# Altium project ISL6236.PrjPcb
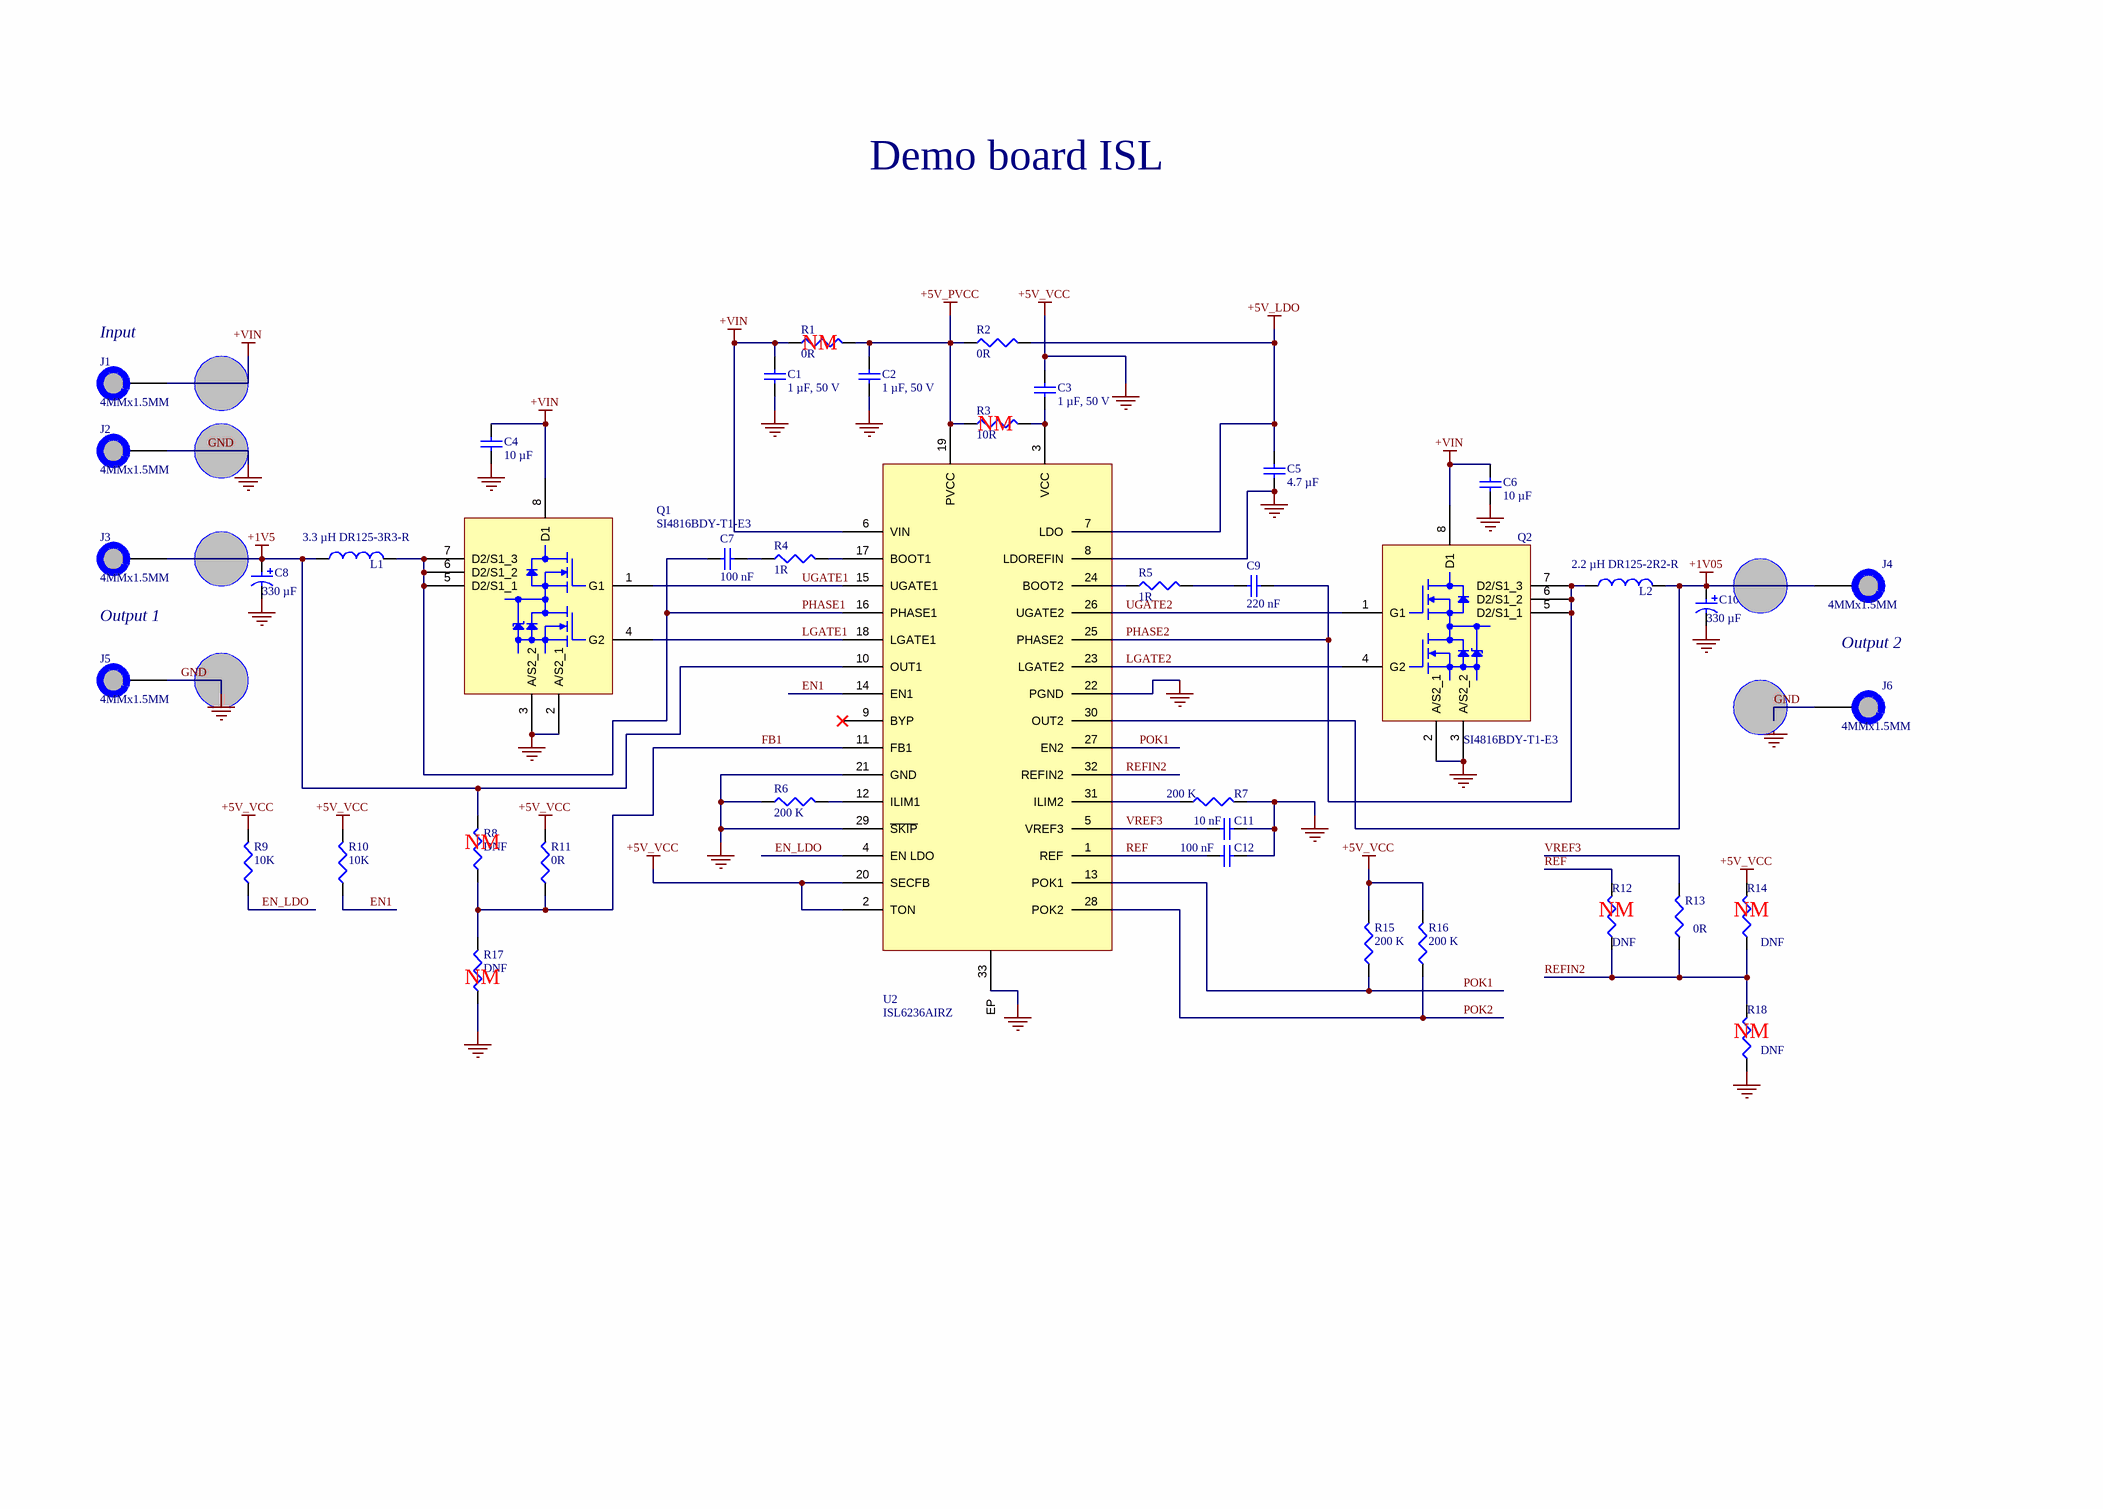
[diagram p0: ISL6236_demo.SchDoc]
1 sheet, 41 parts. Net scope: global (net labels, ports and power ports of the same name join across sheets).
Board file: ISL62368v1.PcbDoc

## Sheet ISL6236_demo.SchDoc
size A3; Date: 16.07.2024; Author: Naveen Dhage Shankar; CompanyName: ETAS GmbH; Engineer: Naveen Dhage Shankar; Organization: ETAS GmbH; Revision: 1; SheetNumber: 1; SheetTotal: 1

### Parts
C1  1 µF, 50 V  [C0805]
C2  1 µF, 50 V  [C0805]
C3  1 µF, 50 V  [C0805]
C4  10 µF  [C1210]
C5  4.7 µF  [C1206]
C6  10 µF  [C1210]
C7  100 nF  [C0805]
C8  330 µF  [C1210]
C9  220 nF  [C0805]
C10  330 µF  [C1210]
C11  10 nF  [C0805]
C12  100 nF  [C0805]
J1  4MMx1.5MM  [PAD_HOLE_4MMx1MM5]
J2  4MMx1.5MM  [PAD_HOLE_4MMx1MM5]
J3  4MMx1.5MM  [PAD_HOLE_4MMx1MM5]
J4  4MMx1.5MM  [PAD_HOLE_4MMx1MM5]
J5  4MMx1.5MM  [PAD_HOLE_4MMx1MM5]
J6  4MMx1.5MM  [PAD_HOLE_4MMx1MM5]
L1  3.3 µH DR125-3R3-R  [DR125]
L2  2.2 µH DR125-2R2-R  [DR125]
Q1  SI4816BDY-T1-E3  [SO-8]
Q2  SI4816BDY-T1-E3  [SO-8]
R1  0R  [R0805]
R2  0R  [R0805]
R3  10R  [R0805]
R4  1R  [R0805]
R5  1R  [R0805]
R6  200 K  [R0805]
R7  200 K  [R0805]
R8  DNF  [R0805]
R9  10K  [R0805]
R10  10K  [R0805]
R11  0R  [R0805]
R12  DNF  [R0805]
R13  0R  [R0805]
R14  DNF  [R0805]
R15  200 K  [R0805]
R16  200 K  [R0805]
R17  DNF  [R0805]
R18  DNF  [R0805]
U2  ISL6236AIRZ  [L32.5x5B]

### Nets
+1V05: C10.1 J4.1 L2.2 U2.30(OUT2)
+1V5: C8.1 J3.1 L1.1 R8.2 U2.10(OUT1)
+5V_LDO: C5.2 R2.2 U2.7(LDO)
+5V_PVCC: C2.2 R1.2 R2.1 R3.1 U2.19(PVCC)
+VIN: C1.2 C4.2 C6.2 J1.1 Q1.8(D1) Q2.8(D1) R1.1 U2.6(VIN)
GND: C1.1 C2.1 C3.2 C4.1 C5.1 C6.1 C8.2 C10.2 C11.2 C12.2 J2.1 J5.1 J6.1 Q1.2(A/S2_1) Q1.3(A/S2_2) Q2.2(A/S2_1) Q2.3(A/S2_2) R6.1 R7.2 R9.2 R10.2 R11.2 R14.2 R15.2 R16.2 R17.1 R18.1 U2.2(TON) U2.8(LDOREFIN) U2.20(SECFB) U2.21(GND) U2.22(PGND) U2.29(~{SKIP})  [also labelled +5V_VCC]
EN1: R10.1 U2.14(EN1)
EN_LDO: R9.1 U2.4(EN_LDO)
FB1: R8.1 R11.1 R17.2 U2.11(FB1)
LGATE1: Q1.4(G2) U2.18(LGATE1)
LGATE2: Q2.4(G2) U2.23(LGATE2)
PHASE1: C7.1 L1.2 Q1.5(D2/S1_1) Q1.6(D2/S1_2) Q1.7(D2/S1_3) U2.16(PHASE1)
PHASE2: C9.1 L2.1 Q2.5(D2/S1_1) Q2.6(D2/S1_2) Q2.7(D2/S1_3) U2.25(PHASE2)
POK1: R15.1 U2.13(POK1) U2.27(EN2)
POK2: R16.1 U2.28(POK2)
REF: C12.1 R12.2 U2.1(REF)
REFIN2: R12.1 R13.1 R14.1 R18.2 U2.32(REFIN2)
UGATE1: Q1.1(G1) U2.15(UGATE1)
UGATE2: Q2.1(G1) U2.26(UGATE2)
VREF3: C11.1 R13.2 U2.5(VREF3)
NetC3_1: C3.1 R3.2 U2.3(VCC)
NetC7_2: C7.2 R4.1
NetC9_2: C9.2 R5.2
NetR4_2: R4.2 U2.17(BOOT1)
NetR5_1: R5.1 U2.24(BOOT2)
NetR6_2: R6.2 U2.12(ILIM1)
NetR7_1: R7.1 U2.31(ILIM2)

Not connected (* = marked no-connect by the designer): U2 9(BYP)* 33(EP)

### Notes on the sheet
- Demo board ISL
- (near J1) Input
- (near R1) NM
- (near R3) NM
- Output 1
- Output 2
- (near R8) NM
- (near R12) NM
- (near R14) NM
- (near R17) NM
- (near R18) NM

### Library data of the parts
C1-C3 = C0805C105K5RACTU: Multilayer Ceramic Capacitor, 1 uF, 50 V, ± 10%, X7R, 0805 [2012 Metric]; Manufacturer: KEMET; Material: 4241ConductorMaterial; Value: 1uF; Voltage Rating: 50V; Supplier: Digikey; Supplier Part Number: 399-C0805C105K5RAC7800CT-ND; Manufacturer Part Number: C0805C105K5RACTU; RoHS: Yes; Category: Ceramic Capacitors; Stock: 75674; Pricing: 1=0,35, 10=0,231, 50=0,1704, 100=0,1387, 500=0,10954, 1000=0,0925 (USD); Mounting Technology: Surface Mount,PCB; Case/Package: 0805; Case Code (Metric): 2012; Case Code (Imperial): 0805; Dielectric Material: Ceramic; Min Operating Temperature: -55°C; Max Operating Temperature: 125°C; Packaging: Tape and Reel; Tolerance: 10%; Voltage Rating (DC): 50V; Package Quantity: 1; Dielectric: X7R; Termination: SMD/SMT; Voltage: 50V; Series: C; Construction: Flat; Length: 2mm; Width: 0.049inch; Height: 1.25mm; Thickness: 0.055inch; Depth: 1.25mm; Reach SVHC Compliant: No; RoHS Compliant: Yes; ComponentLink1URL: https://datasheet.ciiva.com/7842/1732744-7842192.pdf?src-supplier=Element14; ComponentLink1Description: https://datasheet.ciiva.com/7842/1732744-7842192.pdf?src-supplier=Element14; ComponentLink2URL: https://datasheet.ciiva.com/22700/1851736-22700523.pdf?src-supplier=Element14; ComponentLink2Description: https://datasheet.ciiva.com/22700/1851736-22700523.pdf?src-supplier=Element14
C4 C6 = C1210C106K6PACTU: Multilayer Ceramic Capacitor, 10 uF, 35 V, ± 10%, X5R, 1210 [3225 Metric]; Manufacturer: KEMET; Value: 10uF; Voltage Rating: 35V; Dissipation Factor: 2.5%; Supplier: Digikey; Supplier Part Number: 399-12070-1-ND; Manufacturer Part Number: C1210C106K6PACTU; RoHS: Yes; Category: Ceramic Capacitors; Stock: 21511; Pricing: 1=0,72, 10=0,503, 50=0,424, 100=0,3452, 500=0,28766 (USD); Mounting Technology: Surface Mount; Case/Package: 1210; Case Code (Metric): 3225; Case Code (Imperial): 1210; Dielectric Material: Ceramic; Min Operating Temperature: -55°C; Max Operating Temperature: 85°C; Packaging: Cut Tape; Voltage: 35V; Dielectric: X5R; Termination: Solder; Tolerance: 10%; Series: SMD Comm X5R; Voltage Rating (DC): 35V; Length: 3.2mm; Height: 1.9mm; Depth: 2.5mm; RoHS Compliant: Yes; Lead Free: 5697LeadFree; ComponentLink1URL: http://www.farnell.com/datasheets/2741192.pdf?src-supplier=Farnell; ComponentLink1Description: http://www.farnell.com/datasheets/2741192.pdf?src-supplier=Farnell; ComponentLink2URL: http://www.alliedelec.com/m/d/f3c02ddb98afa3dd1adcb801109671e9.pdf?src-supplier=Allied+Electronics; ComponentLink2Description: http://www.alliedelec.com/m/d/f3c02ddb98afa3dd1adcb801109671e9.pdf?src-supplier=Allied+Electronics; ComponentLink3URL: https://datasheet.octopart.com/C1210C106K6PACTU-KEMET-datasheet-83562113.pdf?src-supplier=Newark; ComponentLink3Description: https://datasheet.octopart.com/C1210C106K6PACTU-KEMET-datasheet-83562113.pdf?src-supplier=Newark; ComponentLink4URL: http://www.farnell.com/datasheets/2741192.pdf?src-supplier=Newark; ComponentLink4Description: http://www.farnell.com/datasheets/2741192.pdf?src-supplier=Newark; ComponentLink5URL: https://datasheet.octopart.com/C1210C106K6PACTU-KEMET-datasheet-86448939.pdf?src-supplier=Farnell; ComponentLink5Description: https://datasheet.octopart.com/C1210C106K6PACTU-KEMET-datasheet-86448939.pdf?src-supplier=Farnell; ComponentLink6URL: https://api.kemet.com/component-edge/download/datasheet/C1210C106K6PAC7800.pdf?src-supplier=Digikey; ComponentLink6Description: https://api.kemet.com/component-edge/download/datasheet/C1210C106K6PAC7800.pdf?src-supplier=Digikey; ComponentLink7URL: http://www.kemet.com/docfinder?Partnumber=C1210C106K6PAC7800&src-supplier=Digikey; ComponentLink7Description: http://www.kemet.com/docfinder?Partnumber=C1210C106K6PAC7800&src-supplier=Digikey; ComponentLink8URL: https://datasheet.octopart.com/C1210C106K6PACTU-KEMET-datasheet-130260269.pdf?src-supplier=TME; ComponentLink8Description: https://datasheet.octopart.com/C1210C106K6PACTU-KEMET-datasheet-130260269.pdf?src-supplier=TME
C5 = C3216X5R1H475K160AB: C Series 1206 4.7 uF 50 V ±10 % Tolerance X5R SMT Multilayer Ceramic Capacitor; Manufacturer: TDK; Supplier: Arrow Electronics; Supplier Part Number: C3216X5R1H475K160AB; Manufacturer Part Number: C3216X5R1H475K160AB; RoHS: Yes; Category: Ceramic Capacitors; Stock: 714; Pricing: 487=0,2054, 500=0,1924 (USD); ComponentLink1URL: https://datasheet.ciiva.com/24216/c3216x5r1h475k160ab-265269-24216325.pdf?src-supplier=Mouser; ComponentLink1Description: https://datasheet.ciiva.com/24216/c3216x5r1h475k160ab-265269-24216325.pdf?src-supplier=Mouser; ComponentLink2URL: https://datasheet.ciiva.com/6286/tdkmlcccaprange-6286230.pdf?src-supplier=Digikey; ComponentLink2Description: https://datasheet.ciiva.com/6286/tdkmlcccaprange-6286230.pdf?src-supplier=Digikey; ComponentLink3URL: https://datasheet.ciiva.com/6286/tdkmlcccaprange-6286233.pdf?src-supplier=Digikey; ComponentLink3Description: https://datasheet.ciiva.com/6286/tdkmlcccaprange-6286233.pdf?src-supplier=Digikey; ComponentLink4URL: https://datasheet.ciiva.com/6286/tdkmlcccaprange-6286236.pdf?src-supplier=Digikey; ComponentLink4Description: https://datasheet.ciiva.com/6286/tdkmlcccaprange-6286236.pdf?src-supplier=Digikey
C7 C12 = C0805C104K5RACTU: Multilayer Ceramic Capacitor, 0.1 uF, 50 V, ± 10%, X7R, 0805 [2012 Metric]; Manufacturer: KEMET; Material: 4241ConductorMaterial; Value: 100nF; Voltage Rating: 50V; Voltage: 500V; Temperature Coefficient: 30ppm/°C; Supplier: Digikey; Supplier Part Number: 399-C0805C104K5RAC7800CT-ND; Manufacturer Part Number: C0805C104K5RACTU; RoHS: Yes; Category: Ceramic Capacitors; Stock: 2819204; Pricing: 1=0,14, 10=0,091, 50=0,0546, 100=0,043, 500=0,03172, 1000=0,02627 (USD); Mounting Technology: Surface Mount,PCB; Case/Package: 0805; Pins: 2; Case Code (Imperial): 0805; Case Code (Metric): 2012; Min Operating Temperature: -55°C; Max Operating Temperature: 125°C; Package Quantity: 4000; Tolerance: 10%; Packaging: Tape and Reel; Voltage Rating (DC): 50V; Dielectric: X7R; Termination: SMD/SMT; Series: SMD Comm X7R; Construction: Flat; Length: 2mm; Width: 1.2mm; Height: 0.9mm; Lead Pitch: 0.75mm; Depth: 1.25mm; Radiation Hardening: No; Reach SVHC Compliant: No; RoHS Compliant: Yes; Lead Free: 5697LeadFree; ComponentLink1URL: https://datasheet.ciiva.com/32431/slceramic-chip-condensers-e-32431755.pdf?src-supplier=Distrelec; ComponentLink1Description: https://datasheet.ciiva.com/32431/slceramic-chip-condensers-e-32431755.pdf?src-supplier=Distrelec; ComponentLink2URL: https://datasheet.ciiva.com/28682/1851736-28682232.pdf?src-supplier=Element14; ComponentLink2Description: https://datasheet.ciiva.com/28682/1851736-28682232.pdf?src-supplier=Element14
C8 C10 = T530X337M010AHE004: Cap Tant Solid 330uF 10V X CASE 20% (7.3 X 4.3 X 4mm) SMD 7343-43 0.004 Ohm 125 C T/R; Manufacturer: KEMET; Supplier: Digikey; Supplier Part Number: 399-10376-1-ND; Manufacturer Part Number: T530X337M010AHE004; RoHS: No; Category: Tantalum Capacitors; Stock: 915; Pricing: 1=7,14, 10=6,191, 50=5,5562, 100=4,8259 (USD); ComponentLink1URL: https://datasheet.ciiva.com/11214/datasheetpn-t530x337m010ahe004-11214039.pdf?src-supplier=Avnet; ComponentLink1Description: https://datasheet.ciiva.com/11214/datasheetpn-t530x337m010ahe004-11214039.pdf?src-supplier=Avnet
C9 = C0805C224K5RACTU: Multilayer Ceramic Capacitor, 0.22 uF, 50 V, ± 10%, X7R, 0805 [2012 Metric]; Manufacturer: KEMET; Material: 4241ConductorMaterial; Value: 220nF; Voltage Rating: 50V; Dissipation Factor: 2.5%; Temperature Coefficient: 30ppm/°C; Supplier: Digikey; Supplier Part Number: 399-C0805C224K5RACTUCT-ND; Manufacturer Part Number: C0805C224K5RACTU; RoHS: Yes; Category: Ceramic Capacitors; Stock: 489532; Pricing: 1=0,16, 10=0,106, 50=0,063, 100=0,0496, 500=0,03666, 1000=0,03035 (USD); Mounting Technology: Surface Mount,PCB; Case/Package: 0805; Case Code (Metric): 2012; Case Code (Imperial): 0805; Dielectric Material: Ceramic; Min Operating Temperature: -55°C; Max Operating Temperature: 125°C; Package Quantity: 4000; Tolerance: 10%; Packaging: Tape and Reel; Voltage Rating (DC): 50V; Dielectric: X7R; Termination: SMD/SMT; Voltage: 50V; Series: SMD Comm X7R; Construction: Flat; Length: 2mm; Width: 1.2mm; Height: 1.1mm; Lead Pitch: 0.75mm; Depth: 1.25mm; Radiation Hardening: No; Reach SVHC Compliant: No; RoHS Compliant: Yes; Lead Free: 5697LeadFree; ComponentLink1URL: https://datasheet.ciiva.com/7842/kem-c1002-x7r-smd-7842582.pdf?src-supplier=Element14; ComponentLink1Description: https://datasheet.ciiva.com/7842/kem-c1002-x7r-smd-7842582.pdf?src-supplier=Element14; ComponentLink2URL: https://datasheet.ciiva.com/28682/1851736-28682316.pdf?src-supplier=Element14; ComponentLink2Description: https://datasheet.ciiva.com/28682/1851736-28682316.pdf?src-supplier=Element14; ComponentLink3URL: https://datasheet.ciiva.com/14589/70095383-14589519.pdf?src-supplier=Allied+Electronics; ComponentLink3Description: https://datasheet.ciiva.com/14589/70095383-14589519.pdf?src-supplier=Allied+Electronics; ComponentLink4URL: https://datasheet.ciiva.com/14603/70095383-14603247.pdf?src-supplier=Allied+Electronics; ComponentLink4Description: https://datasheet.ciiva.com/14603/70095383-14603247.pdf?src-supplier=Allied+Electronics
C11 = C0805F103K5RACTU: 0805 C 10nF Ceramic Multilayer Capacitor; 50 VDC; +125degC; X7R Dielec; +/-10%; Manufacturer: KEMET; Voltage Rating: 50V; Tolerance: 10%; Supplier: Digikey; Supplier Part Number: 399-C0805F103K5RAC7800CT-ND; Manufacturer Part Number: C0805F103K5RACTU; RoHS: Yes; Category: Ceramic Capacitors; Stock: 5487; Pricing: 1=0,24, 10=0,158, 50=0,111, 100=0,0897, 500=0,06662, 1000=0,0583 (USD); Mounting Technology: Surface Mount; Case/Package: 0805; Pins: 2; Case Code (Imperial): 0805; Case Code (Metric): 2012; Min Operating Temperature: -55°C; Max Operating Temperature: 125°C; Value: 10nF; Package Quantity: 1; Voltage Rating (DC): 50V; Packaging: Cut Tape; Dielectric: X7R; Termination: SMD/SMT; Series: FO-CAP; Construction: Flat; Voltage Rating (AC): 50V; Length: 2mm; Width: 0.049inch; Height: 0.9mm; Lead Pitch: 0.75mm; Thickness: 0.039inch; Depth: 1.25mm; Reach SVHC Compliant: No; RoHS Compliant: Yes; Lead Free: 5697LeadFree; ComponentLink1URL: https://datasheet.ciiva.com/7842/48829-7842408.pdf?src-supplier=Element14; ComponentLink1Description: https://datasheet.ciiva.com/7842/48829-7842408.pdf?src-supplier=Element14; ComponentLink2URL: https://datasheet.ciiva.com/7842/48829-7842407.pdf?src-supplier=Element14; ComponentLink2Description: https://datasheet.ciiva.com/7842/48829-7842407.pdf?src-supplier=Element14
J1-J6 = PAD_HOLE_4MMx1MM5: Pad with hole 4 mm x 1.5 mm
L1 = DR125-3R3-R: Inductor Power Shielded Drum Core 3.3uH 20% 100KHz Ferrite 9.26A 6.3mOhm DCR T/R; Manufacturer: Eaton - Electronics Division; Supplier: Digikey; Supplier Part Number: 513-1529-1-ND; Manufacturer Part Number: DR125-3R3-R; RoHS: No; Category: Uncategorized
L2 = DR125-2R2-R: Ind Power Shielded Wirewound 2.2uH 20% 100KHz Ferrite 10.9A T/R; Manufacturer: Eaton Cooper; Supplier: Digikey; Supplier Part Number: 513-1662-1-ND; Manufacturer Part Number: DR125-2R2-R; RoHS: Yes; Category: Fixed Inductors; Stock: 2128; Pricing: 1=1,21, 10=1,02, 25=0,9276, 50=0,8718, 100=0,7234, 250=0,6678 (USD); Lead Free: 5697LeadFree; ComponentLink1URL: https://datasheet.ciiva.com/14667/0900766b8116a153-14667792.pdf?src-supplier=Rs; ComponentLink1Description: https://datasheet.ciiva.com/14667/0900766b8116a153-14667792.pdf?src-supplier=Rs; ComponentLink2URL: https://datasheet.ciiva.com/26926/getdatasheetpartid-571249-26926912.pdf?src-supplier=Verical; ComponentLink2Description: https://datasheet.ciiva.com/26926/getdatasheetpartid-571249-26926912.pdf?src-supplier=Verical; ComponentLink3URL: https://datasheet.ciiva.com/8004/87246-8004874.pdf?src-supplier=Element14; ComponentLink3Description: https://datasheet.ciiva.com/8004/87246-8004874.pdf?src-supplier=Element14
Q1 Q2 = SI4816BDY-T1-E3: Transistor MOSFET Array Dual N-CH 30V 5.8A/8.2A 8-Pin SOIC T/R; Manufacturer: Vishay Siliconix; Supplier: Digikey; Supplier Part Number: SI4816BDY-T1-E3CT-ND; Manufacturer Part Number: SI4816BDY-T1-E3; RoHS: Yes; Category: MOSFETs; Stock: 4824; Pricing: 1=1,58, 10=1,311, 100=1,0438, 500=0,88324, 1000=0,74942 (USD); ComponentLink1URL: https://datasheet.ciiva.com/15137/getdatasheetpartid-99188-15137841.pdf?src-supplier=Verical; ComponentLink1Description: https://datasheet.ciiva.com/15137/getdatasheetpartid-99188-15137841.pdf?src-supplier=Verical; ComponentLink2URL: https://datasheet.ciiva.com/928/si4816bd-928458.pdf?src-supplier=Digikey; ComponentLink2Description: https://datasheet.ciiva.com/928/si4816bd-928458.pdf?src-supplier=Digikey; ComponentLink3URL: https://datasheet.ciiva.com/928/si4816bd-928459.pdf?src-supplier=Digikey; ComponentLink3Description: https://datasheet.ciiva.com/928/si4816bd-928459.pdf?src-supplier=Digikey; ComponentLink4URL: https://datasheet.ciiva.com/928/si4816bd-928460.pdf?src-supplier=Digikey; ComponentLink4Description: https://datasheet.ciiva.com/928/si4816bd-928460.pdf?src-supplier=Digikey; ComponentLink5URL: https://datasheet.ciiva.com/11161/si4816bd-11161496.pdf?src-supplier=Avnet; ComponentLink5Description: https://datasheet.ciiva.com/11161/si4816bd-11161496.pdf?src-supplier=Avnet; ComponentLink6URL: https://datasheet.ciiva.com/16486/si4816bd-16486349.pdf?src-supplier=Future+Electronics; ComponentLink6Description: https://datasheet.ciiva.com/16486/si4816bd-16486349.pdf?src-supplier=Future+Electronics; ComponentLink7URL: https://datasheet.ciiva.com/18448/70026226-18448822.pdf?src-supplier=Allied+Electronics; ComponentLink7Description: https://datasheet.ciiva.com/18448/70026226-18448822.pdf?src-supplier=Allied+Electronics
R1 R2 R11 R13 = AC0805JR-070RL: Zero Ohm Resistor, 0805 [2012 Metric], Thick Film, 125 mW, 2 A, Surface Mount; Manufacturer: Yageo; Power Rating: 125mW; Tolerance: 5%; Voltage Rating: 150V; Temperature Coefficient: 200ppm/°C; Supplier: Digikey; Supplier Part Number: YAG3755CT-ND; Manufacturer Part Number: AC0805JR-070RL; RoHS: Yes; Category: Chip SMD Resistors; Stock: 196918; Pricing: 1=0,1, 10=0,035, 25=0,0272, 50=0,0206, 100=0,0144, 250=0,0116, 500=0,00928, 1000=0,00683 (USD); Case/Package: 0805; Case Code (Imperial): 0805; Case Code (Metric): 2012; Min Operating Temperature: -55°C; Max Operating Temperature: 155°C; Packaging: Tape and Reel; Value: 0R; Termination: SMD/SMT; Number of Terminations: 2; Max Power Dissipation: 125mW; Features: Moisture Resistant,Automotive AEC-Q200; Series: AC; Length: 0.079inch; Width: 1.25mm; Height: 0.024inch; RoHS Compliant: Yes; Lead Free: 5697LeadFree; ComponentLink1URL: https://datasheet.octopart.com/AC0805JR-070RL-Yageo-datasheet-166720450.pdf?src-supplier=Future+Electronics; ComponentLink1Description: https://datasheet.octopart.com/AC0805JR-070RL-Yageo-datasheet-166720450.pdf?src-supplier=Future+Electronics; ComponentLink2URL: http://www.yageo.com/documents/recent/PYu-AC_51_RoHS_L_2.pdf?src-supplier=Mouser; ComponentLink2Description: http://www.yageo.com/documents/recent/PYu-AC_51_RoHS_L_2.pdf?src-supplier=Mouser
R3 = AC0805FR-0710RL: SMD Chip Resistor, 10 Ohm, ± 1%, 125 mW, 0805 [2012 Metric], Thick Film, General Purpose; Manufacturer: Yageo; Supplier: Digikey; Supplier Part Number: YAG3690CT-ND; Manufacturer Part Number: AC0805FR-0710RL; RoHS: Yes; Category: Chip SMD Resistors; Stock: 169137; Pricing: 1=0,11, 10=0,052, 50=0,0338, 100=0,0286, 500=0,02014, 1000=0,01754 (USD); ComponentLink1URL: http://www.mouser.com/ds/2/447/yageodocoutput-1111992.pdf?src-supplier=Mouser; ComponentLink1Description: http://www.mouser.com/ds/2/447/yageodocoutput-1111992.pdf?src-supplier=Mouser; ComponentLink2URL: http://www.yageo.com/NewPortal/yageodocoutput?fileName=/pdf/R-Chip/PYu-AC_51_RoHS_L_6.pdf&src-supplier=Digikey; ComponentLink2Description: http://www.yageo.com/NewPortal/yageodocoutput?fileName=/pdf/R-Chip/PYu-AC_51_RoHS_L_6.pdf&src-supplier=Digikey; ComponentLink3URL: https://www.yageo.com/upload/media/product/productsearch/datasheet/rchip/PYu-AC_51_RoHS_L_7.pdf?src-supplier=Digikey; ComponentLink3Description: https://www.yageo.com/upload/media/product/productsearch/datasheet/rchip/PYu-AC_51_RoHS_L_7.pdf?src-supplier=Digikey; ComponentLink4URL: http://www.yageo.com/documents/recent/PYu-AC_51_RoHS_L_2_revised.pdf?src-supplier=Future+Electronics; ComponentLink4Description: http://www.yageo.com/documents/recent/PYu-AC_51_RoHS_L_2_revised.pdf?src-supplier=Future+Electronics
R4 R5 = AC0805FR-071RL: SMD Chip Resistor, 1 Ohm, ± 1%, 125 mW, 0805 [2012 Metric], Thick Film, General Purpose; Manufacturer: Yageo; Supplier: Digikey; Supplier Part Number: YAG3705CT-ND; Manufacturer Part Number: AC0805FR-071RL; RoHS: Yes; Category: Chip SMD Resistors; Stock: 71458; Pricing: 1=0,1, 10=0,036, 50=0,0238, 100=0,0201, 500=0,01416, 1000=0,01233 (USD); Lead Free: 5697LeadFree; ComponentLink1URL: https://datasheet.ciiva.com/12576/pyu-ac-51-rohs-l-2-12576553.pdf?src-supplier=Mouser; ComponentLink1Description: https://datasheet.ciiva.com/12576/pyu-ac-51-rohs-l-2-12576553.pdf?src-supplier=Mouser
R6 R7 R15 R16 = AC0805FR-07200KL: SMD Chip Resistor, 200 kOhm, ± 1%, 125 mW, 0805 [2012 Metric], Thick Film, General Purpose; Manufacturer: Yageo; Supplier: Digikey; Supplier Part Number: YAG3706CT-ND; Manufacturer Part Number: AC0805FR-07200KL; RoHS: Yes; Category: Chip SMD Resistors; Stock: 25141; Pricing: 1=0,1, 10=0,031, 50=0,0198, 100=0,0166, 500=0,01152, 1000=0,00997 (USD); Lead Free: 5697LeadFree; ComponentLink1URL: http://www.mouser.com/ds/2/447/yageodocoutput-1111992.pdf?src-supplier=Mouser; ComponentLink1Description: http://www.mouser.com/ds/2/447/yageodocoutput-1111992.pdf?src-supplier=Mouser; ComponentLink2URL: https://datasheet.octopart.com/AC0805FR-07200KL-Yageo-datasheet-151884373.pdf?src-supplier=Future+Electronics; ComponentLink2Description: https://datasheet.octopart.com/AC0805FR-07200KL-Yageo-datasheet-151884373.pdf?src-supplier=Future+Electronics; ComponentLink3URL: http://www.yageo.com/NewPortal/yageodocoutput?fileName=/pdf/R-Chip/PYu-AC_51_RoHS_L_6.pdf&src-supplier=Digikey; ComponentLink3Description: http://www.yageo.com/NewPortal/yageodocoutput?fileName=/pdf/R-Chip/PYu-AC_51_RoHS_L_6.pdf&src-supplier=Digikey; ComponentLink4URL: http://www.yageo.com/documents/recent/PYu-AC_51_RoHS_L_2.pdf?src-supplier=Future+Electronics; ComponentLink4Description: http://www.yageo.com/documents/recent/PYu-AC_51_RoHS_L_2.pdf?src-supplier=Future+Electronics
R8 R12 R14 R17 R18 = RES
R9 R10 = AC0805FR-0710KL: SMD Chip Resistor, 10 kOhm, ± 1%, 125 mW, 0805 [2012 Metric], Thick Film, General Purpose; Manufacturer: Yageo; Supplier: Digikey; Supplier Part Number: 311-10KLGCT-ND; Manufacturer Part Number: AC0805FR-0710KL; RoHS: Yes; Category: Chip SMD Resistors; Stock: 449609; Pricing: 1=0,1, 10=0,031, 50=0,0198, 100=0,0166, 500=0,01152, 1000=0,00997 (USD); ComponentLink1URL: https://datasheet.ciiva.com/5558/pyu-ac-51-rohs-l-2-5558347.pdf?src-supplier=Mouser; ComponentLink1Description: https://datasheet.ciiva.com/5558/pyu-ac-51-rohs-l-2-5558347.pdf?src-supplier=Mouser
U2 = ISL6236AIRZ: ISL6236A Series 25 V Dual Step-Down Switch-Mode Power-Supply Controller - QFN-32; Manufacturer: Renesas; Frequency: 500kHz; Output Voltage: 5.5V; Supplier: Digikey; Supplier Part Number: ISL6236AIRZ-ND; Manufacturer Part Number: ISL6236AIRZ; RoHS: Yes; Stock: 2220; Pricing: 1=6,37, 10=5,754, 25=5,4868, 80=4,76413, 230=4,55004, 490=4,14857, 980=3,61328, 2450=3,47945 (USD); ComponentLink1URL: https://datasheet.octopart.com/ISL6236AIRZ-Renesas-datasheet-138160199.pdf?src-supplier=Future+Electronics; ComponentLink1Description: https://datasheet.octopart.com/ISL6236AIRZ-Renesas-datasheet-138160199.pdf?src-supplier=Future+Electronics; ComponentLink2URL: http://www.intersil.com/content/dam/Intersil/documents/isl6/isl6236a.pdf?src-supplier=Digikey; ComponentLink2Description: http://www.intersil.com/content/dam/Intersil/documents/isl6/isl6236a.pdf?src-supplier=Digikey